# EAGLE schematic i21_JOYBIT_v03_(4_4x) (EAGLE 7.2.0)
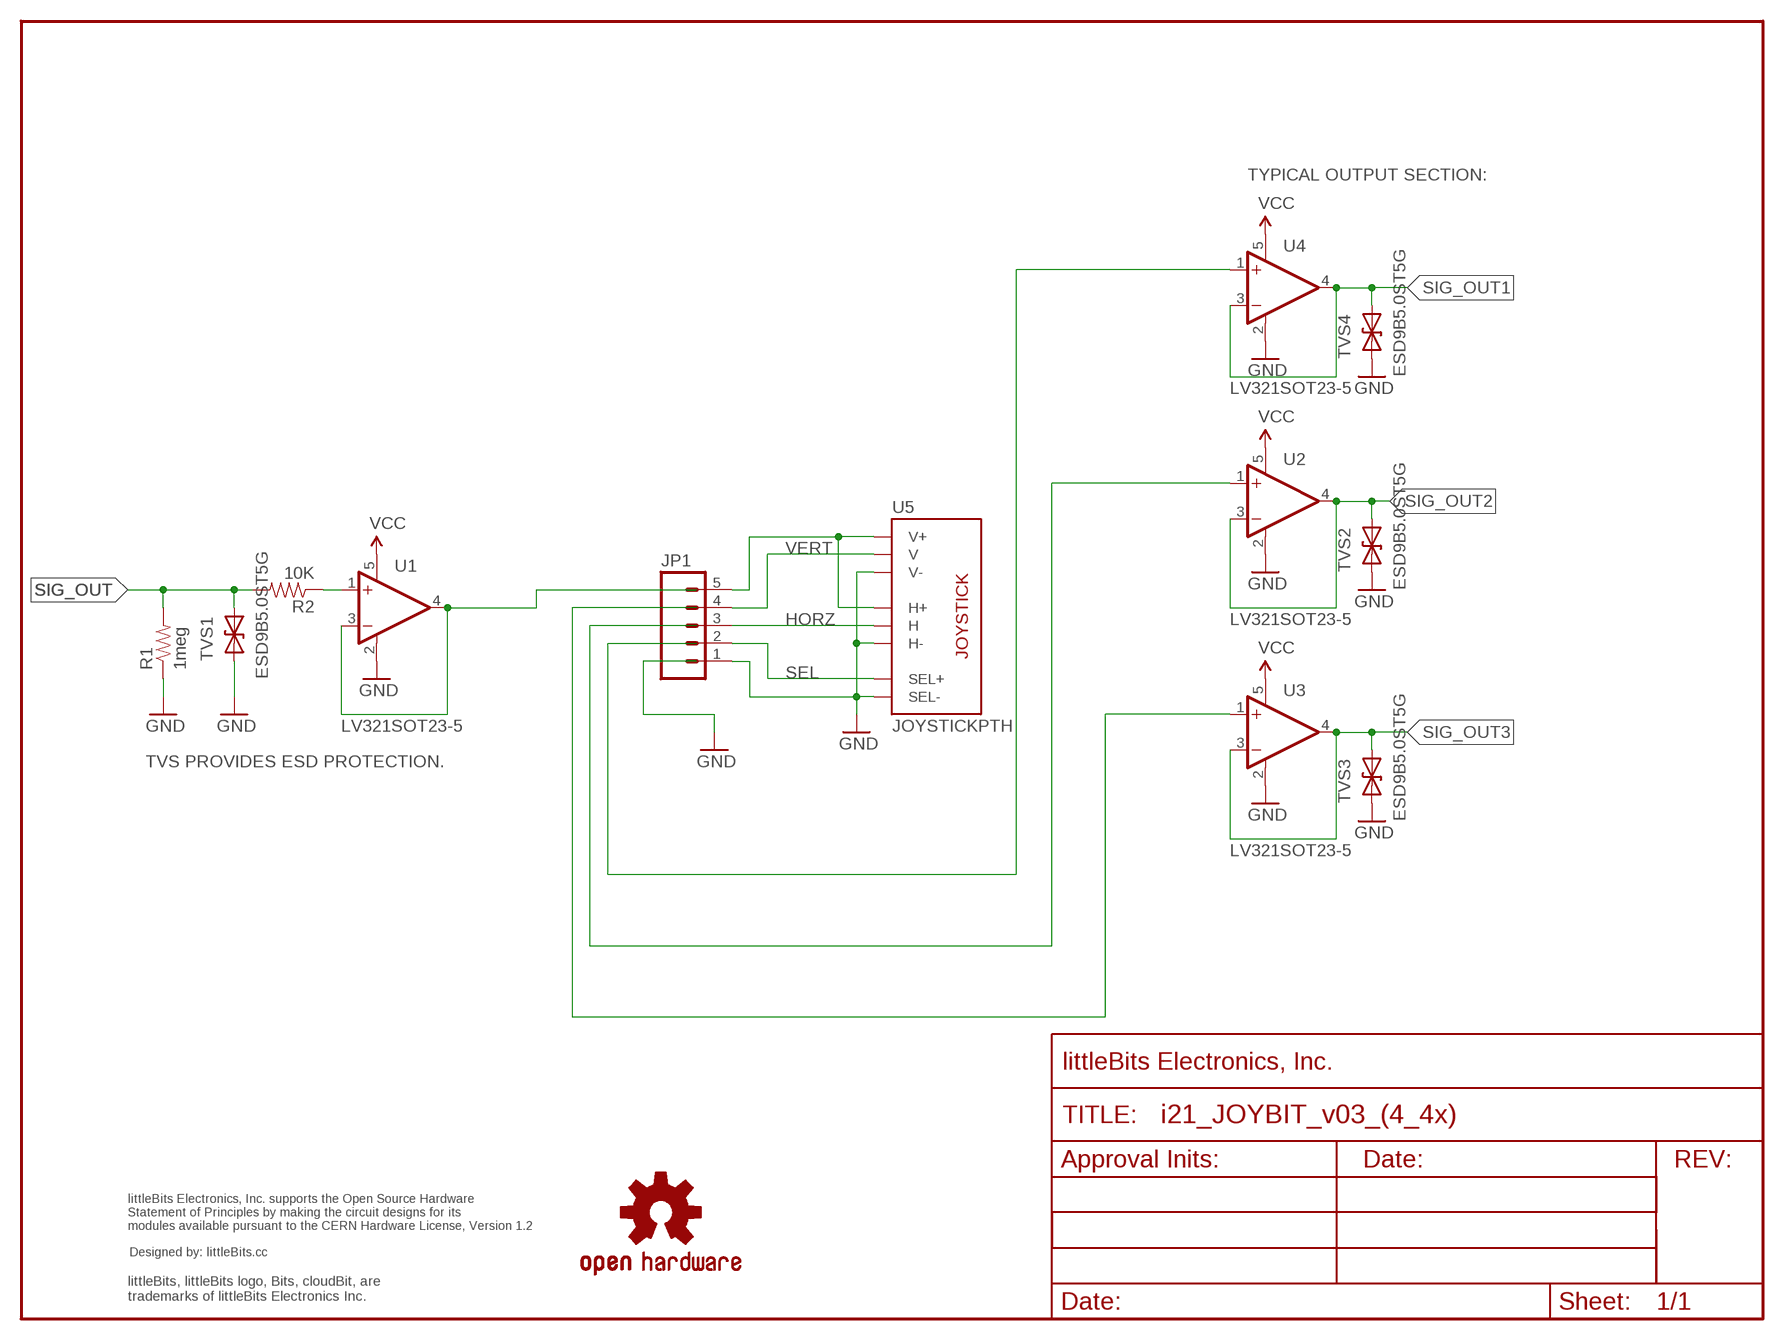
[diagram p0: schematic, sheet 1]

## Parts
FRAME1  FRAME-LETTER  [FABDWG01-OHW]
JP1  M05PTH  [1X05]
R1  1meg  RESISTOR0603  [RES-0603]
R2  10K  RESISTOR0603  [RES-0603]
TVS1  ESD9B5.0ST5G  DIODE-TVSSOD-923  [SOD-923]
TVS2  ESD9B5.0ST5G  DIODE-TVSSOD-923  [SOD-923]
TVS3  ESD9B5.0ST5G  DIODE-TVSSOD-923  [SOD-923]
TVS4  ESD9B5.0ST5G  DIODE-TVSSOD-923  [SOD-923]
U1  LV321SOT23-5  [SOT23-5]
U2  LV321SOT23-5  [SOT23-5]
U3  LV321SOT23-5  [SOT23-5]
U4  LV321SOT23-5  [SOT23-5]
U5  JOYSTICKPTH  [JOYSTICK]
U$2  OSHWCREDIT  [OSHWCREDIT]
U$3  OSHW-LOGOL  [OSHW-LOGO-L]

## Nets
GND: JP1.1 R1.1 TVS1.1(A) TVS2.1(A) TVS3.1(A) TVS4.1(A) U1.2(V-) U2.2(V-) U3.2(V-) U4.2(V-) U5.B2A(SEL-) U5.H3(H-) U5.V3(V-)
HORZ: JP1.3 U5.H2(H)
N$1: U2.1(+IN)
N$2: U3.1(+IN)
N$3: U1.3(-IN) U1.4(OUT)
N$4: R2.1 U1.1(+IN)
N$5: JP1.5 U5.H1(H+) U5.V1(V+)
N$12: U4.1(+IN)
SEL: JP1.2 U5.B1A(SEL+)
SIG_OUT: R1.2 R2.2 TVS1.2(C)
SIG_OUT1: TVS4.2(C) U4.3(-IN) U4.4(OUT)
SIG_OUT2: TVS2.2(C) U2.3(-IN) U2.4(OUT)
SIG_OUT3: TVS3.2(C) U3.3(-IN) U3.4(OUT)
VCC: U1.5(V+) U2.5(V+) U3.5(V+) U4.5(V+)
VERT: JP1.4 U5.V2(V)

## Notes on the sheet
- TYPICAL OUTPUT SECTION:
- TVS PROVIDES ESD PROTECTION.

## Library data of the parts
FRAME1 = LITTLEBITS:FRAME-LETTER
JP1 = SparkFun:M05: Header 5 Standard 5-pin 0.1" header. Use with straight break away headers (SKU : PRT-00116), right angle break away headers (PRT-00553), swiss pins (PRT-00743), machine pins (PRT-00117), and female headers (PRT-00115). Molex polarized connector foot print use with SKU : PRT-08230 with associated crimp pins and housings.
R1 R2 = LITTLEBITS:RESISTOR
TVS1-TVS4 = LITTLEBITS:DIODE-TVS: Bidirectional Transient Voltage Suppression Diode: Device conducts in avalanche mode after reaching a part dependent voltage threshold. Used for limiting voltage spikes on ESD sensitive inputs and outputs.; IEC_ESD_PROT0: +/-18kV; LB_PN: ?; MPN: ESD9B5.0ST5G; V_CLAMP: ?; V_OPERATION: 5V
U1-U4 = LITTLEBITS:LV321
U5 = SparkFun:JOYSTICK: Thumb Joystick Joystick commonly found in PS2 controllers. Two pots and a select switch. Footprint proven. Spark Fun Electronics SKU : COM-09032
U$2 = LITTLEBITS:OSHWCREDIT
U$3 = LITTLEBITS131206:OSHW-LOGO: Open Source Hardware Logo This logo indicates the piece of hardware it is found on incorporates a OSHW license and/or adheres to the definition of open source hardware found here: http://freedomdefined.org/OSHW